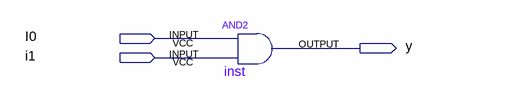
[diagram p0: schematic sheet]
// Quartus schematic GameDemo.bdf as structural Verilog: 1 symbols, 3 pins
module GameDemo (
  input  I0,
  input  i1,
  output y
);

  and inst (y, I0, i1);
endmodule
